# EAGLE schematic I2C (EAGLE 9.3.1)
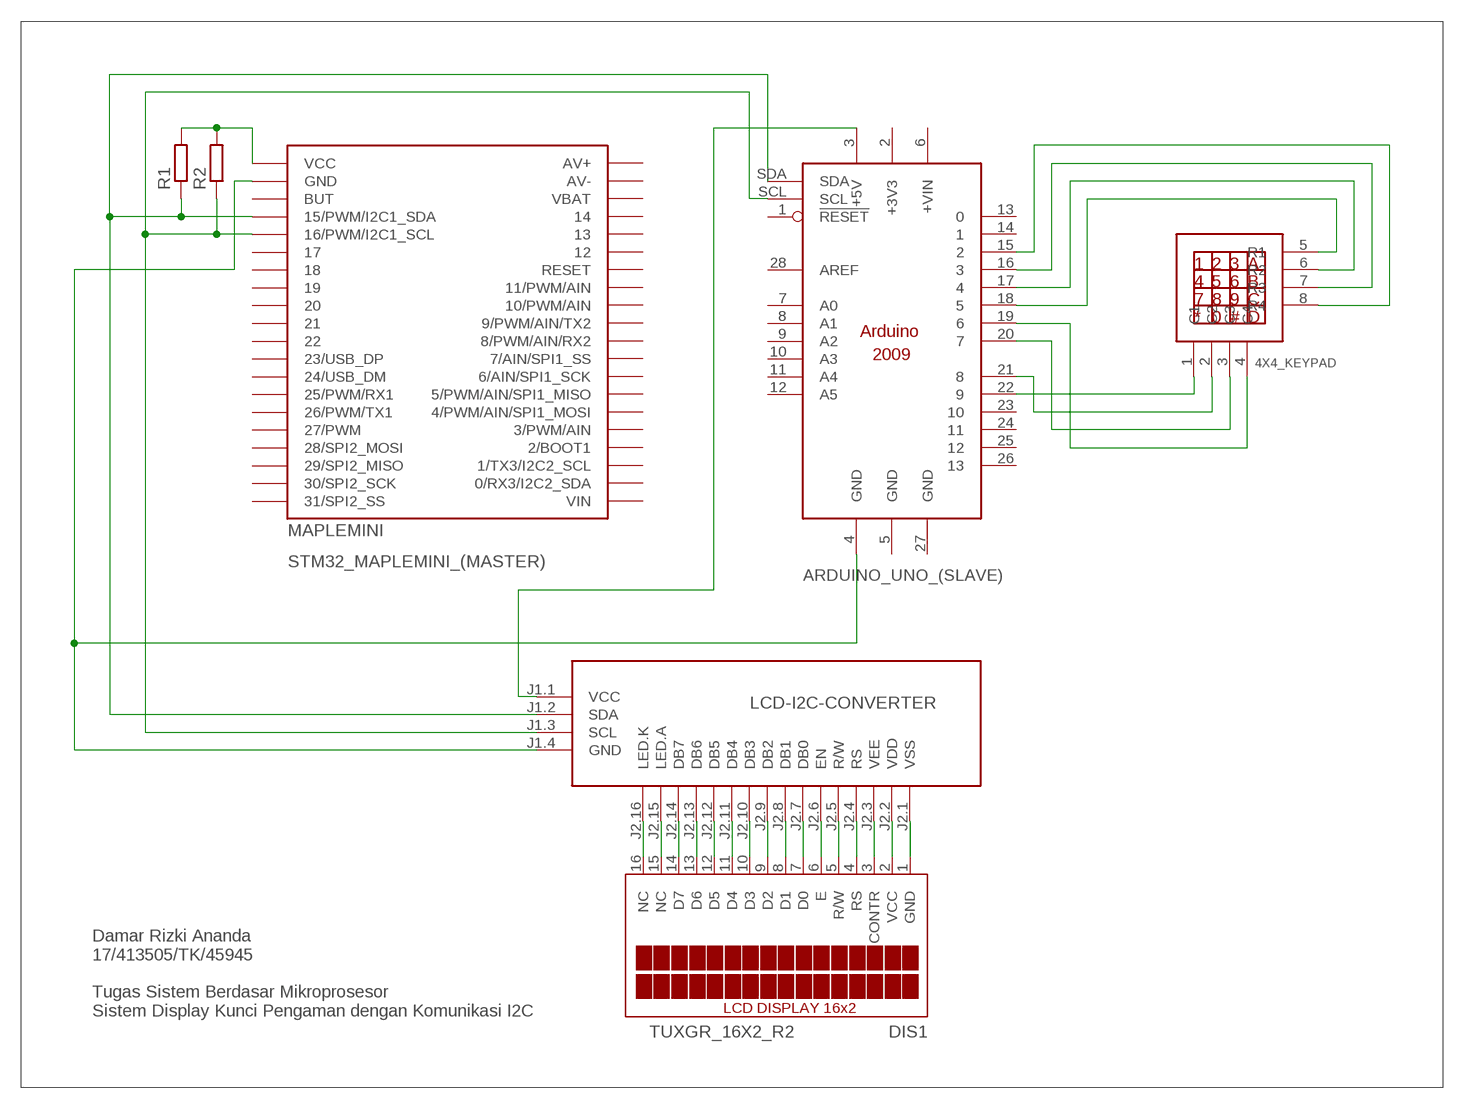
[diagram p0: schematic, sheet 1]

## Parts
4X4_KEYPAD  KEYPAD4X4  [KEYPAD4X4]
ARDUINO_UNO_(SLAVE)  ARDUINO2009_12  [ARDUINO2009_2]
DIS1  TUXGR_16X2_R2  [TUXGR_16X2_R2]
R1  R-EU_0309/12  [0309/12]
R2  R-EU_0309/12  [0309/12]
STM32_MAPLEMINI_(MASTER)  MAPLEMINI  [20-DIP]
U$1  LCD-I2C-CONVERTER  [LCD-I2C-CONVERTER]

## Nets
N$1: 4X4_KEYPAD.1(C1) ARDUINO_UNO_(SLAVE).22
N$2: 4X4_KEYPAD.8(R4) ARDUINO_UNO_(SLAVE).15
N$3: 4X4_KEYPAD.7(R3) ARDUINO_UNO_(SLAVE).16
N$4: 4X4_KEYPAD.6(R2) ARDUINO_UNO_(SLAVE).17
N$5: 4X4_KEYPAD.5(R1) ARDUINO_UNO_(SLAVE).18
N$6: 4X4_KEYPAD.2(C2) ARDUINO_UNO_(SLAVE).21
N$7: 4X4_KEYPAD.3(C3) ARDUINO_UNO_(SLAVE).20
N$8: 4X4_KEYPAD.4(C4) ARDUINO_UNO_(SLAVE).19
N$9: DIS1.1(GND) U$1.J2.1(VSS)
N$10: DIS1.2(VCC) U$1.J2.2(VDD)
N$11: DIS1.3(CONTR) U$1.J2.3(VEE)
N$12: DIS1.4(RS) U$1.J2.4(RS)
N$13: DIS1.5(R/W) U$1.J2.5(R/W)
N$14: DIS1.7(D0) U$1.J2.7(DB0)
N$15: DIS1.8(D1) U$1.J2.8(DB1)
N$16: DIS1.9(D2) U$1.J2.9(DB2)
N$17: DIS1.10(D3) U$1.J2.10(DB3)
N$18: DIS1.11(D4) U$1.J2.11(DB4)
N$19: DIS1.12(D5) U$1.J2.12(DB5)
N$20: DIS1.13(D6) U$1.J2.13(DB6)
N$21: DIS1.14(D7) U$1.J2.14(DB7)
N$22: DIS1.15(NC) U$1.J2.15(LED.A)
N$23: DIS1.16(NC) U$1.J2.16(LED.K)
N$24: DIS1.6(E) U$1.J2.6(EN)
N$25: ARDUINO_UNO_(SLAVE).3(+5V) U$1.J1.1(VCC)
N$26: ARDUINO_UNO_(SLAVE).SDA R1.1 STM32_MAPLEMINI_(MASTER).4(15/PWM/I2C1_SDA) U$1.J1.2(SDA)
N$27: ARDUINO_UNO_(SLAVE).SCL R2.1 STM32_MAPLEMINI_(MASTER).5(16/PWM/I2C1_SCL) U$1.J1.3(SCL)
N$28: ARDUINO_UNO_(SLAVE).4(GND) STM32_MAPLEMINI_(MASTER).2(GND) U$1.J1.4(GND)
N$29: R1.2 R2.2 STM32_MAPLEMINI_(MASTER).1(VCC)
Unconnected: ARDUINO_UNO_(SLAVE).1(!RESET) ARDUINO_UNO_(SLAVE).6(+VIN) ARDUINO_UNO_(SLAVE).7(A0) ARDUINO_UNO_(SLAVE).8(A1) ARDUINO_UNO_(SLAVE).9(A2) ARDUINO_UNO_(SLAVE).10(A3) ARDUINO_UNO_(SLAVE).11(A4) ARDUINO_UNO_(SLAVE).12(A5) ARDUINO_UNO_(SLAVE).13 ARDUINO_UNO_(SLAVE).14 ARDUINO_UNO_(SLAVE).23 ARDUINO_UNO_(SLAVE).24 ARDUINO_UNO_(SLAVE).25 ARDUINO_UNO_(SLAVE).26 ARDUINO_UNO_(SLAVE).28(AREF) STM32_MAPLEMINI_(MASTER).3(BUT) STM32_MAPLEMINI_(MASTER).6 STM32_MAPLEMINI_(MASTER).7 STM32_MAPLEMINI_(MASTER).8 STM32_MAPLEMINI_(MASTER).9 STM32_MAPLEMINI_(MASTER).10 STM32_MAPLEMINI_(MASTER).11 STM32_MAPLEMINI_(MASTER).12(23/USB_DP) STM32_MAPLEMINI_(MASTER).13(24/USB_DM) STM32_MAPLEMINI_(MASTER).14(25/PWM/RX1) STM32_MAPLEMINI_(MASTER).15(26/PWM/TX1) STM32_MAPLEMINI_(MASTER).16(27/PWM) STM32_MAPLEMINI_(MASTER).17(28/SPI2_MOSI) STM32_MAPLEMINI_(MASTER).18(29/SPI2_MISO) STM32_MAPLEMINI_(MASTER).19(30/SPI2_SCK) STM32_MAPLEMINI_(MASTER).20(31/SPI2_SS) STM32_MAPLEMINI_(MASTER).21(VIN) STM32_MAPLEMINI_(MASTER).22(0/RX3/I2C2_SDA) STM32_MAPLEMINI_(MASTER).23(1/TX3/I2C2_SCL) STM32_MAPLEMINI_(MASTER).24(2/BOOT1) STM32_MAPLEMINI_(MASTER).25(3/PWM/AIN) STM32_MAPLEMINI_(MASTER).26(4/PWM/AIN/SPI1_MOSI) STM32_MAPLEMINI_(MASTER).27(5/PWM/AIN/SPI1_MISO) STM32_MAPLEMINI_(MASTER).28(6/AIN/SPI1_SCK) STM32_MAPLEMINI_(MASTER).29(7/AIN/SPI1_SS) STM32_MAPLEMINI_(MASTER).30(8/PWM/AIN/RX2) STM32_MAPLEMINI_(MASTER).31(9/PWM/AIN/TX2) STM32_MAPLEMINI_(MASTER).32(10/PWM/AIN) STM32_MAPLEMINI_(MASTER).33(11/PWM/AIN) STM32_MAPLEMINI_(MASTER).34(RESET) STM32_MAPLEMINI_(MASTER).35 STM32_MAPLEMINI_(MASTER).36 STM32_MAPLEMINI_(MASTER).37 STM32_MAPLEMINI_(MASTER).38(VBAT) STM32_MAPLEMINI_(MASTER).39(AV-) STM32_MAPLEMINI_(MASTER).40(AV+)

## Notes on the sheet
- Damar Rizki Ananda
  17/413505/TK/45945
  
  Tugas Sistem Berdasar Mikroprosesor
  Sistem Display Kunci Pengaman dengan Komunikasi I2C

## Power pins joined to a net without a drawn wire
+3V3: ARDUINO_UNO_(SLAVE).2(+3V3)
GND: ARDUINO_UNO_(SLAVE).5(GND) ARDUINO_UNO_(SLAVE).27(GND)

## Library data of the parts
4X4_KEYPAD = keypad_4x4_raw:KEYPAD4X4
ARDUINO_UNO_(SLAVE) = arduino:ARDUINO2009_1: The Arduino Duemilanove ("2009") is a microcontroller board based on the ATmega168 or ATmega328. - 14 digital input/output pins (of which 6 can be used as PWM outputs) - 6 analog inputs, a 16 MHz crystal oscillator - USB connection - power jack - ISP header - reset button It contains everything needed to support the microcontroller; simply connect it to a computer with a USB cable or power it with a AC-to-DC adapter or battery to get started http://arduino.cc/en/Main/ArduinoBoardDuemilanove
DIS1 = display-lcd:TUXGR_16X2_R2: Tuxgraphics LCD display 16x2 characters reflective, without background light Source: tuxgr_12x2_r2.pdf; OC_FARNELL: unknown; OC_NEWARK: unknown
R1 R2 = rcl:R-EU_: RESISTOR, European symbol; SPICEPREFIX: R
STM32_MAPLEMINI_(MASTER) = maplemini:MAPLEMINI
U$1 = diy-modules:LCD-I2C-CONVERTER: I2C Bus to 4-Bit Parallel LCD Interface with LED backlight driver